# Altium schematic sheet Э 3.SchDoc
size 420 x 297 mm; PageSetup: Record=PageOptions|CenterHorizontal=True|CenterVertical=True|PrintScale=1.00|XCorrection=1.00|YCorrection=1.00|PrintKind=1|BorderSize=5000000|LeftOffset=0|BottomOffset=0|Orientation=2|PaperLength=1000|PaperWidth=1000|Scale=100|PaperSource=15|PrintQuality=1200|MediaType=1|DitherType=10|PaperKind=A3|PrintScaleMode=1; Weight: -; ScaleFactor: -; Date: 05.05.2025; CheckedBy: Бойков; Author: Ли; CompanyName: РРБО-01-24; Address1: Address1; Address2: Address2; Address3: Address3; Address4: Address4; DocumentNumber: МРАГ.43 1122.200 Э3; SheetNumber: 1; SheetTotal: 1; Title2str: Плата драйвера; DocumentType: Схема электрическая принципиальная; ProjectName: Драйвер
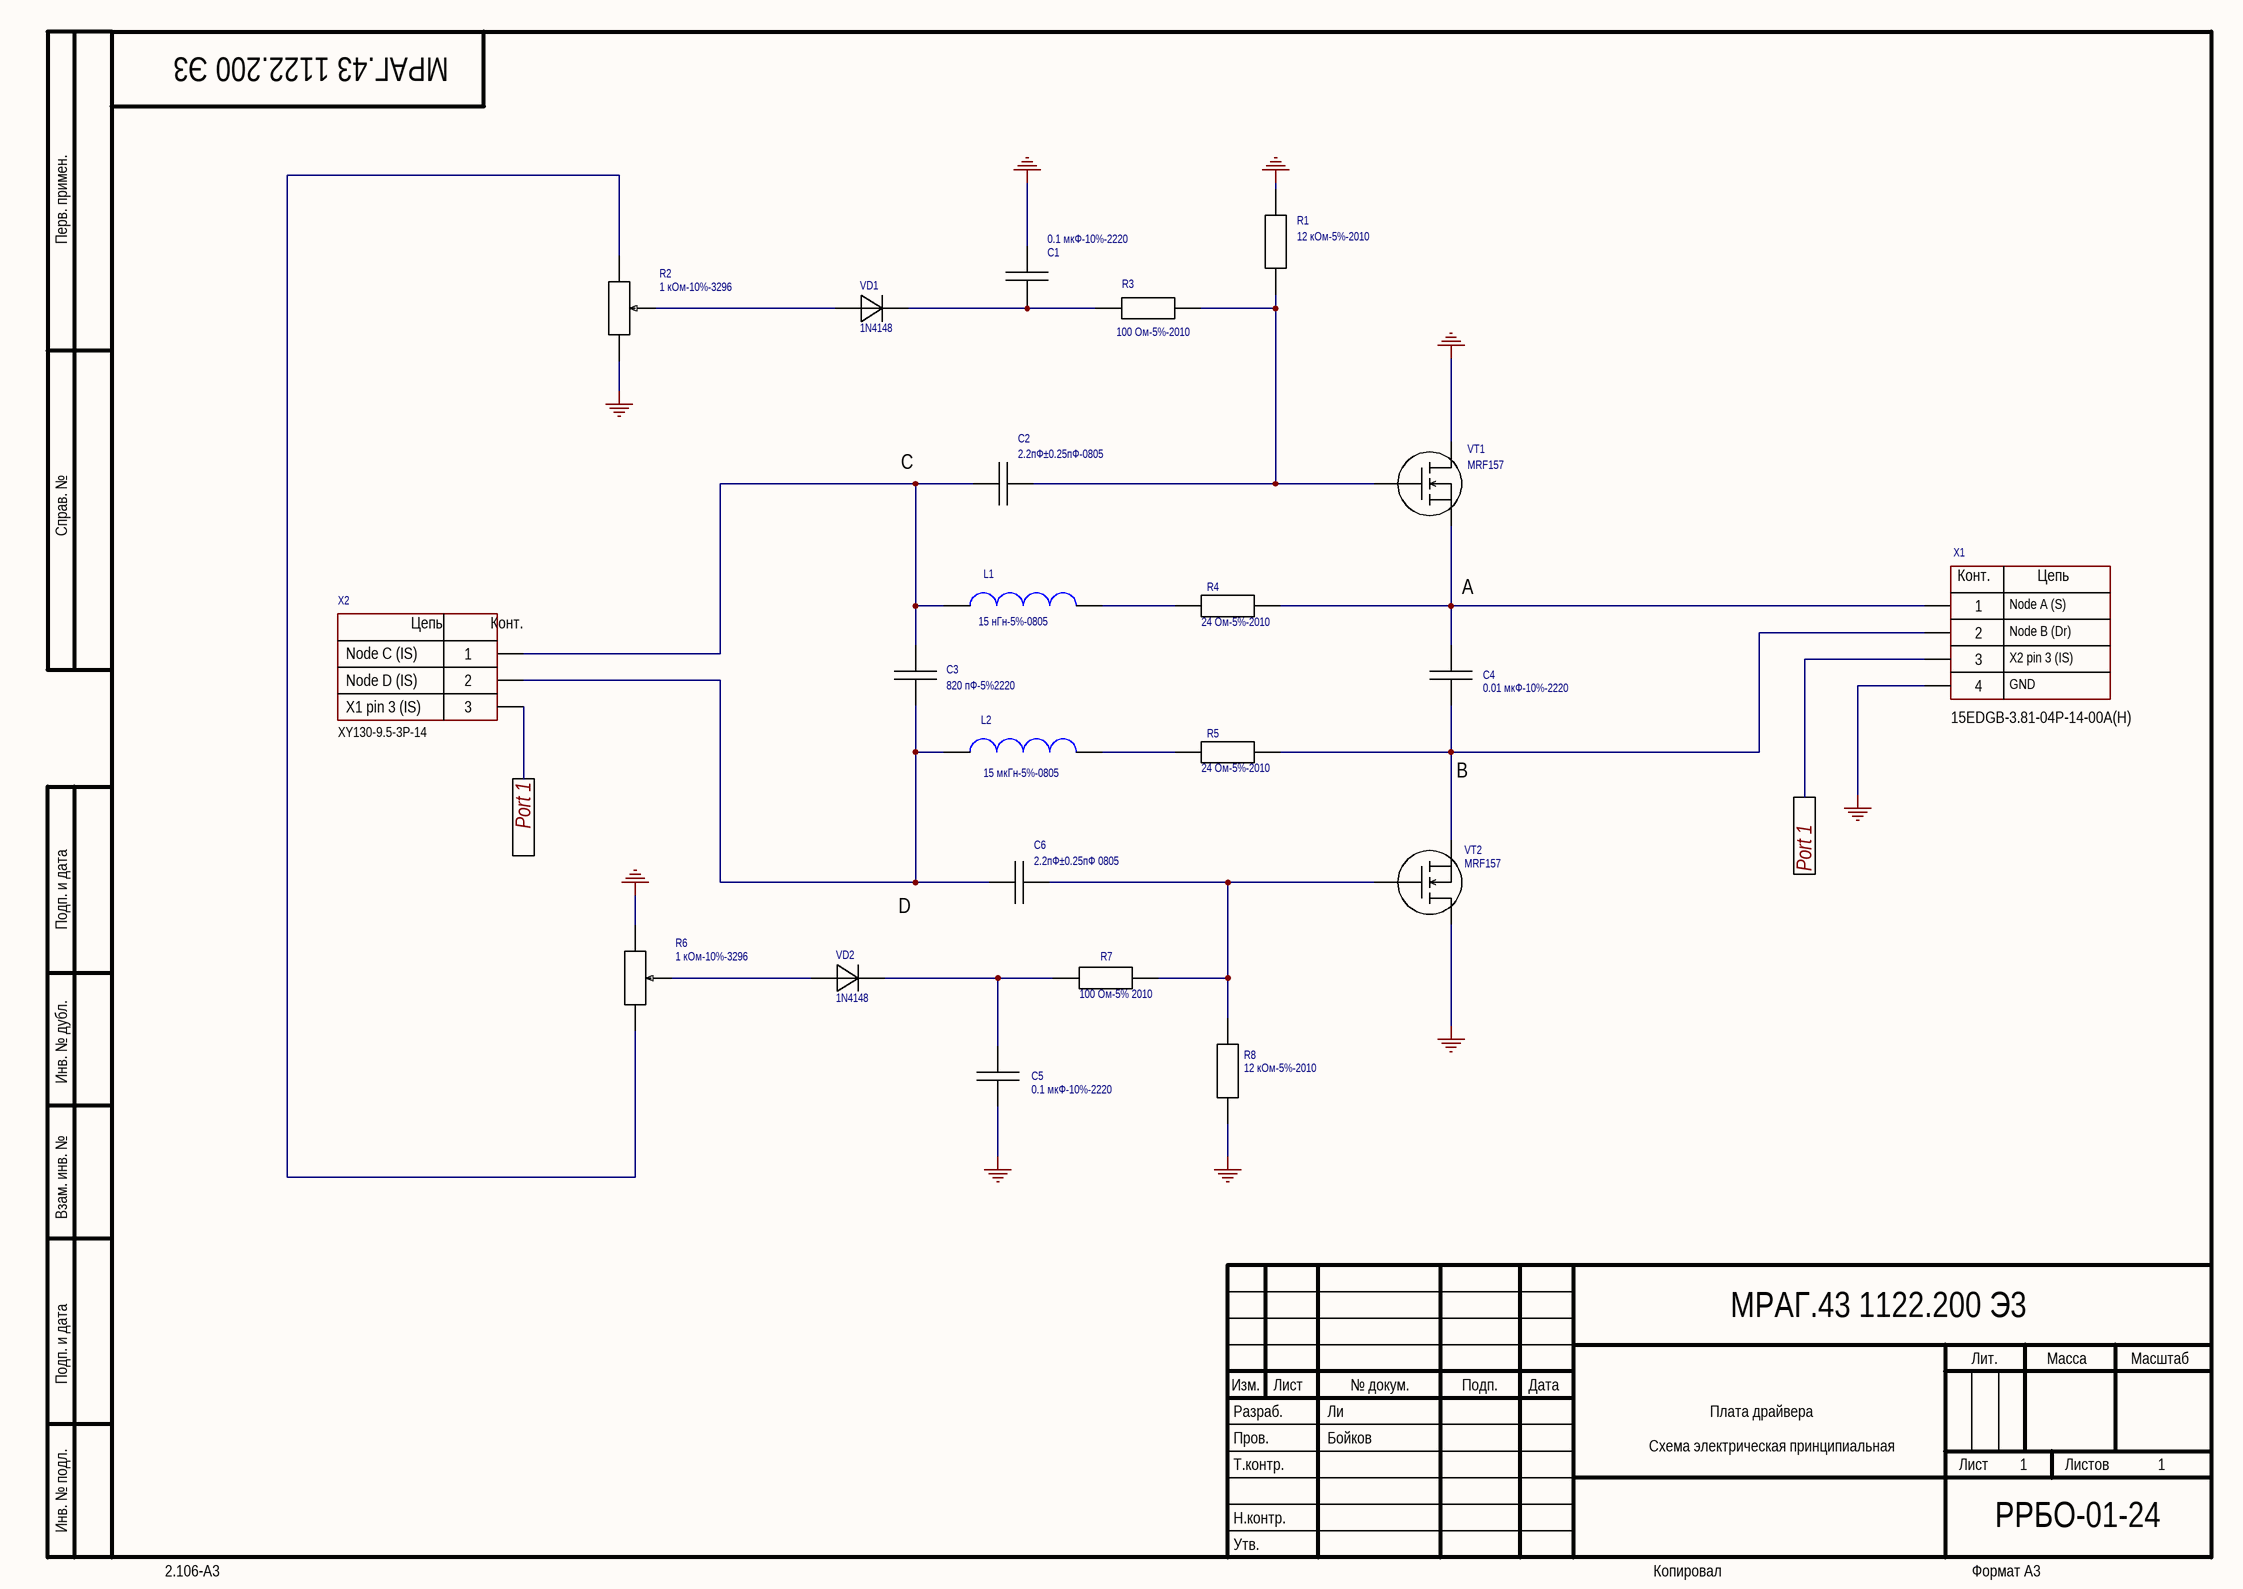
[diagram p0: Э 3.SchDoc]

## Parts
C1  0.1 мкФ-10%-2220  [CAP_2220]
C2  2.2пФ±0.25пФ-0805  [CAP_0805]
C3  820 пФ-5%2220  [CAP_2220]
C4  0.01 мкФ-10%-2220  [CAP_2220]
C5  0.1 мкФ-10%-2220  [CAP_2220]
C6  2.2пФ±0.25пФ 0805  [CAP_0805]
L1  15 нГн-5%-0805  [INDUCTOR_0805]
L2  15 мкГн-5%-0805  [INDUCTOR_0805]
R1  12 кОм-5%-2010  [Resistor_2010]
R2  1 кОм-10%-3296  [TRIMPOT]
R3  100 Ом-5%-2010  [Resistor_2010]
R4  24 Ом-5%-2010  [Resistor_2010]
R5  24 Ом-5%-2010  [Resistor_2010]
R6  1 кОм-10%-3296  [TRIMPOT]
R7  100 Ом-5% 2010  [Resistor_2010]
R8  12 кОм-5%-2010  [Resistor_2010]
VD1  1N4148  [DIODE]
VD2  1N4148  [DIODE]
VT1  MRF157  [MOSFET]
VT2  MRF157  [MOSFET]
X1  15EDGB-3.81-04P-14-00A(H)  [CON: WJ06-04P]
X2  XY130-9.5-3P-14  [CON: WJ06-03P]

## Ports
Port 1

## Nets
GND: C1.1 C5.0 R1.2 R2.1(HIGH) R6.2(LOW) R8.2 VT1.1(Drain) VT2.1(Drain) X1.4
Port 1: X1.3 X2.3 ; port Port 1
NetC1_0: C1.0 R3.1 VD1.1(-)
NetC2_0: C2.0 C3.1 L1.0 X2.1
NetC2_1: C2.1 R1.1 R3.2 VT1.2(Gate)
NetC3_0: C3.0 C6.0 L2.0 X2.2
NetC4_0: C4.0 R5.2 VT2.3(Source) X1.2
NetC4_1: C4.1 R4.2 VT1.3(Source) X1.1
NetC5_1: C5.1 R7.1 VD2.1(-)
NetC6_1: C6.1 R7.2 R8.1 VT2.2(Gate)
NetL1_1: L1.1 R4.1
NetL2_1: L2.1 R5.1
NetR2_2: R2.2(LOW) R6.1(HIGH)
NetR2_3: R2.3(WIPER) VD1.0(+)
NetR6_3: R6.3(WIPER) VD2.0(+)

## Notes on the sheet
- C
- A
- Node C (IS)
- Node A (S)
- Node B (Dr)
- X2 pin 3 (IS)
- Node D (IS)
- (near X2) X1 pin 3 (IS)
- GND
- B
- D
- Перв. примен.
- Справ. №
- Подп. и дата
- Инв. № дубл.
- Взам. инв. №
- Разраб.
- Изм.
- Лист
- № докум.
- Подп.
- Дата
- Лит.
- Масса
- Масштаб
- Пров.
- Т.контр.
- Листов
- Инв. № подл.
- Утв.
- Н.контр.
- 2.106-A3
- Копировал
- Формат А3
- (in symbol 3-Connector) Цепь; Конт.
- (in symbol 4-Connector) Конт.; Цепь

## Library data of the parts
C1 C4 = cond_2220C: PartNumber: C2220C103KGRACAUTO; Manufacturer: Kemet Electronics; Kind: Capacitor; Href: https://www.chipdip.ru/product0/8005312595
  C1: Value: 0.1 мкФ-10%-2220
  C4: Value: 0.01 мкФ-10%-2220
C2 C6 = cond_2220C: PartNumber: GRM2165C1H2R2CD01D; Manufacturer: Murata Electronics; Kind: Capacitor; Href: https://www.chipdip.ru/product/grm2165c1h2r2c
  C2: Value: 2.2пФ±0.25пФ-0805
  C6: Value: 2.2пФ±0.25пФ 0805
C3 = cond_2220C: PartNumber: MC22FF821J-F; Manufacturer: Cornell Dubilier; Kind: Capacitor; Href: https://www.chipdip.ru/product0/8004609482; Value: 820 пФ-5%2220
C5 = cond_2220C: PartNumber: MA2220XR104K500ERG; Manufacturer: PDC; Kind: Capacitor; Href: https://www.chipdip.ru/product0/8001594404; Value: 0.1 мкФ-10%-2220
L1 = inductor: Manufactured: Murata Electronics; PartNumber: LQW2BAS15NJ00L; Kind: Inductors; Href: https://www.chipdip.ru/product0/8005346407; Value: 15 нГн-5%-0805
L2 = inductor: Manufactured: Abracon; PartNumber: AIML-0805-150K-T; Kind: Inductors; Href: https://www.chipdip.ru/product0/8005346407; Value: 15 мкГн-5%-0805
R1 R8 = Resistor_2010R: Manufacturer: Yageo; PartNumber: RC2010JK-0712KL; Href: https://www.chipdip.ru/product0/8147844003; Kind: Resistor; Value: 12 кОм-5%-2010
R2 R6 = Trimpot: Manufacturer: Bourns; PartNumber: 3296X-1-102LF; Kind: Trimpot; Href: https://www.chipdip.ru/product0/8038726753; Value: 1 кОм-10%-3296
R3 R7 = Resistor_2010R: Manufacturer: VIKING; PartNumber: CR-0AJL4--100R; Href: https://www.chipdip.ru/product0/8004209699; Kind: Resistor
  R3: Value: 100 Ом-5%-2010
  R7: Value: 100 Ом-5% 2010
R4 R5 = Resistor_2010R: Manufacturer: VIKING; PartNumber: CR-0AJL4---24R; Href: https://www.chipdip.ru/product0/8014261265; Kind: Resistor; Value: 24 Ом-5%-2010
VD1 VD2 = 1N4148: Manufacturer: Yangzhou Yangjie Electronic Technology Co., Ltd.; Href: https://www.chipdip.ru/product/1n4148-yj; Kind: Diode; PartNumber: 1N4148
VT1 VT2 = MTF157: Kind: Transistor; Manufacturer: *; Href: *; PartNumber: MRF157
X1 = 4-Connector: Manufacturer: Degson Electronics; PartNumber: 15EDGB-3.81-04P-14-00A(H); Href: https://www.chipdip.ru/product/15edgb-3.81-04p-14-00a-h; Kind: Connector
X2 = 3-Connector: Manufacturer: Ningbo Xinya M&E; Model: *; HelpURL: https://www.chipdip.ru/product/dg950-03?from=similar_product_auto; ComponentKind: CONNECTOR; PartNum: XY130-9.5-3P-14